# EasyEDA schematic SCH_depth-sensor_2025-08-24.json
TITLE: Sheet_1; REV: 1.0; Date: 2025-07-07; Sheet: 1/1; Drawn By: saymonislam924; Company: Your Company
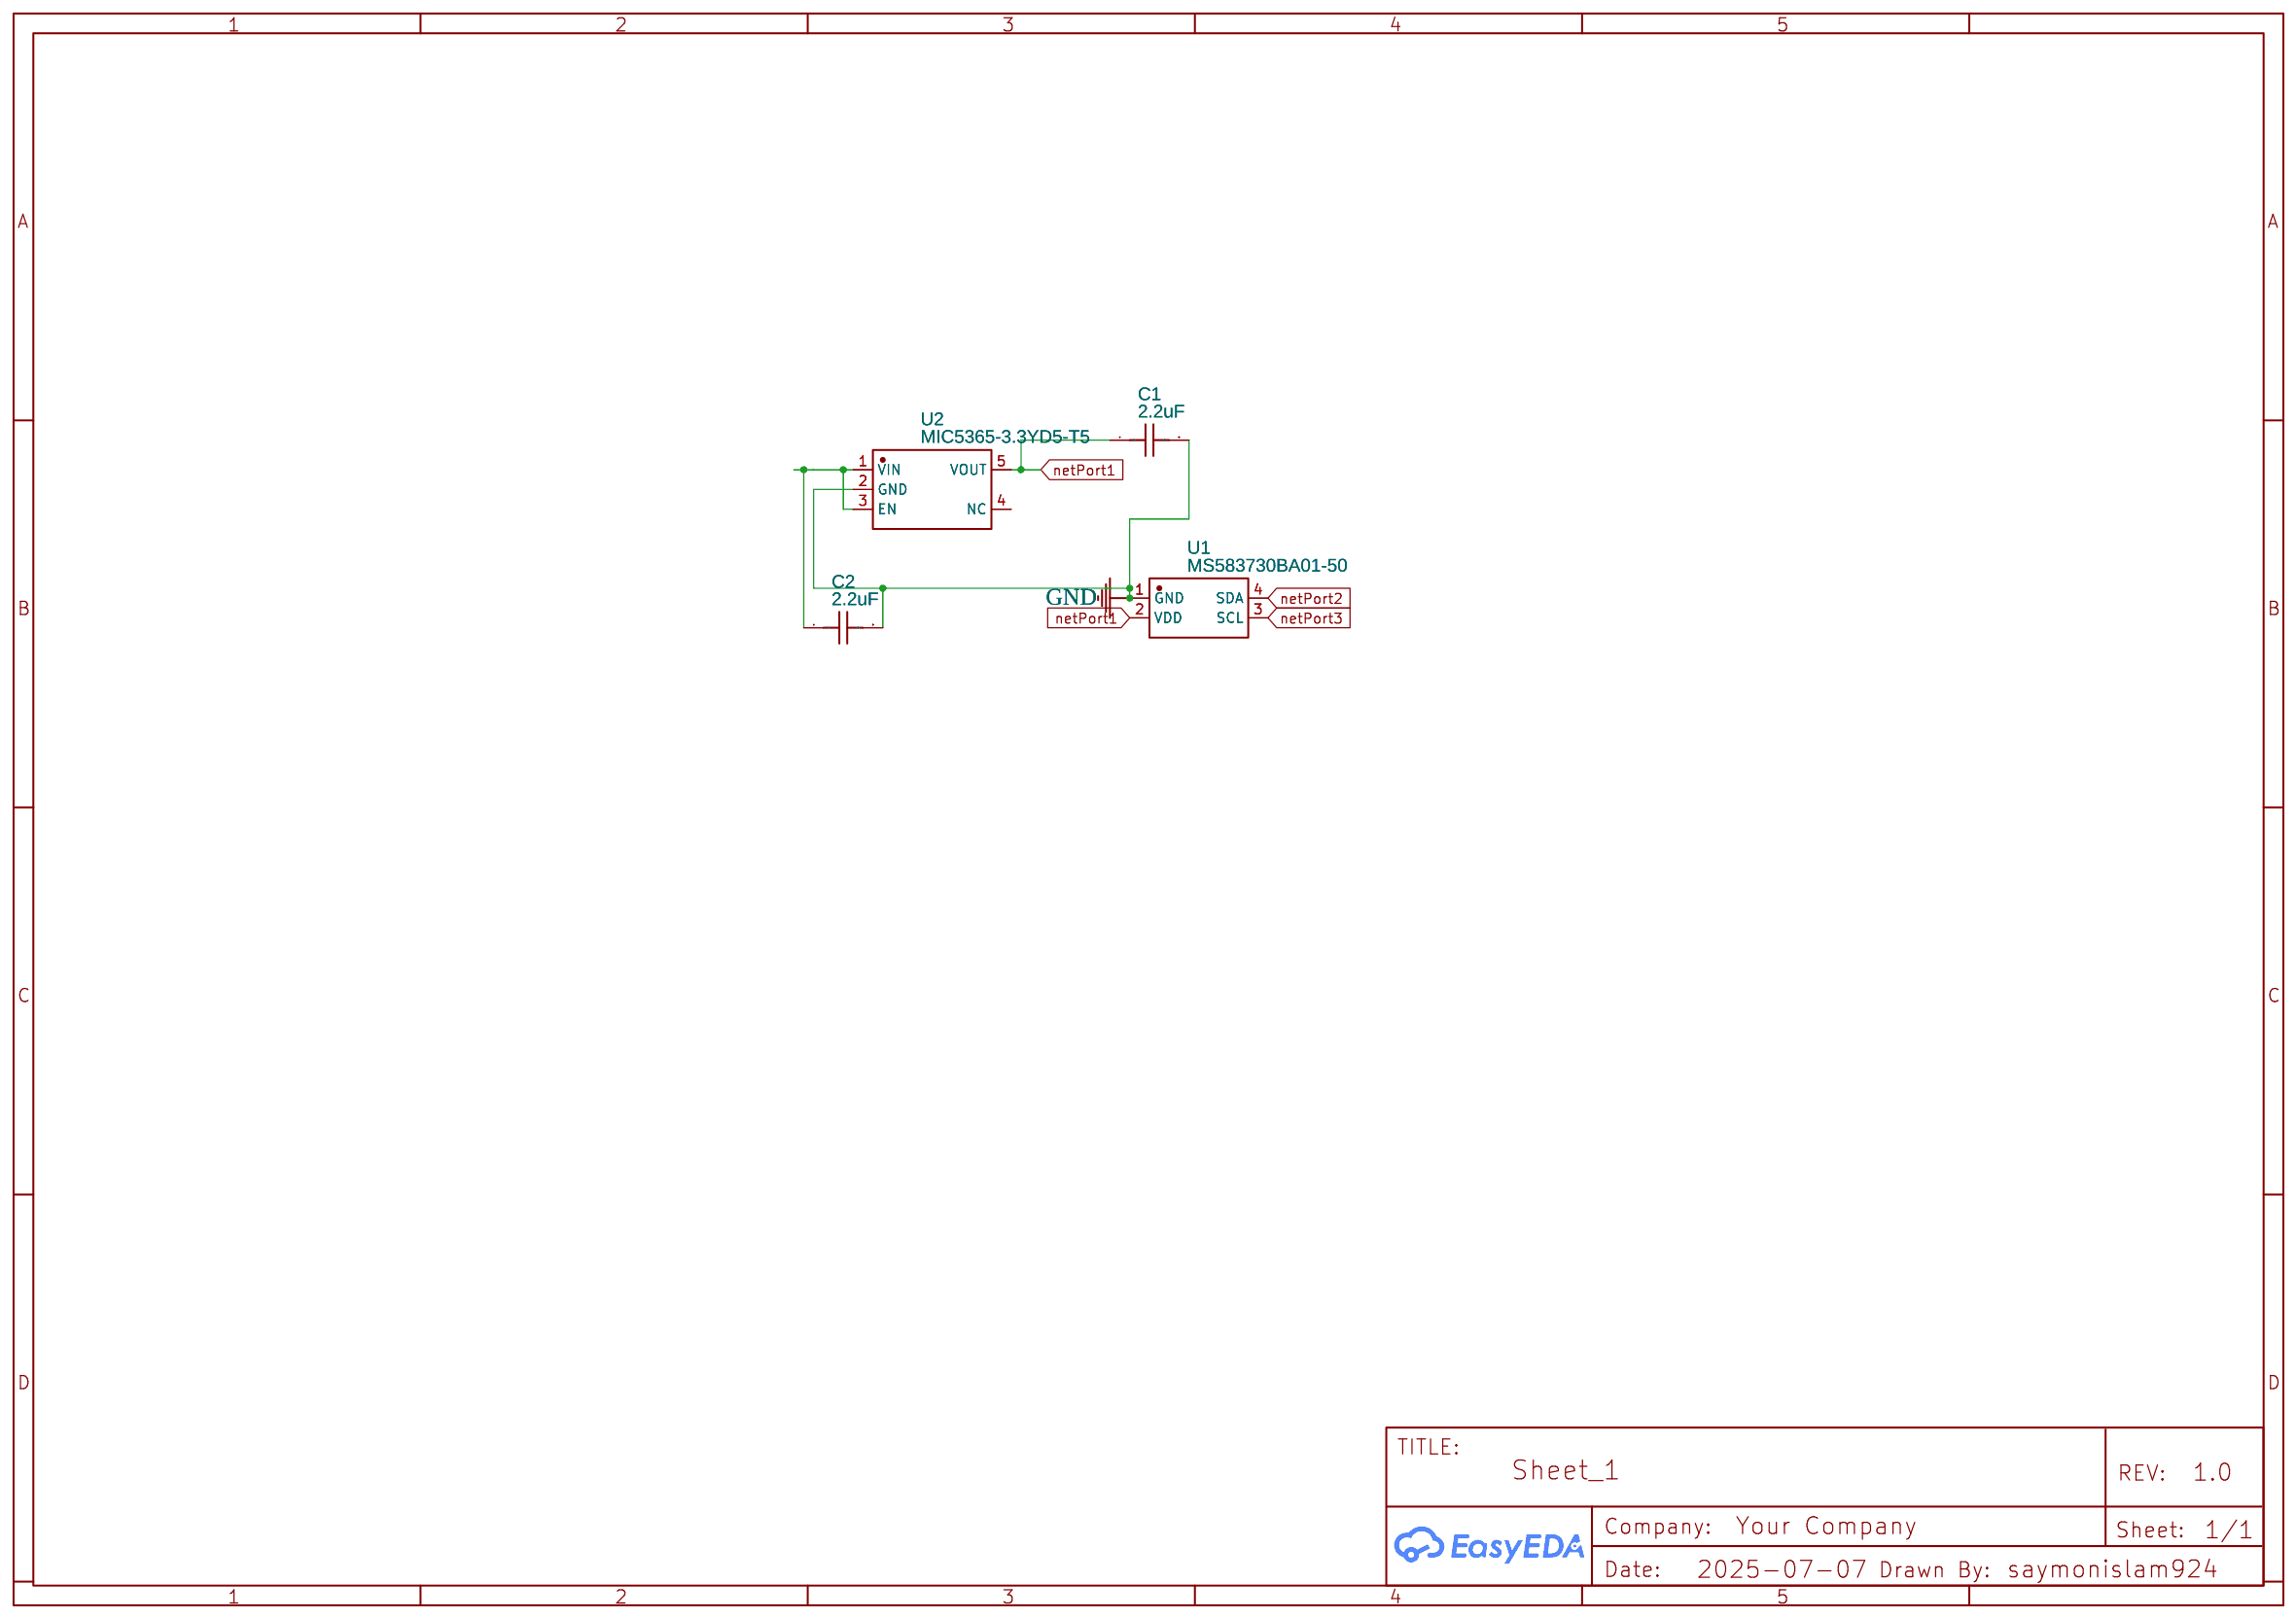
[diagram p0: schematic sheet]

## Parts
C1  2.2uF  [C0603]
C2  2.2uF  [C0603]
U1  MS583730BA01-50  [SENSOR-SMD_4P-L3.3-W3.3-P2.00-BL]
U2  MIC5365-3.3YD5-T5  [TSOT-23-5_L2.9-W1.6-P0.95-LS2.8-BR]

## Library data of the parts
C1 C2 = CC0603KRX7R5BB225: Contributor: lcsc; Supplier: LCSC; Supplier Part: C914880; Manufacturer: YAGEO(国巨); JLCPCB Part Class: Extended Part
U1 = MS583730BA01-50: Contributor: LCSC; Supplier: LCSC; Supplier Part: C2887941; Manufacturer: TE Connectivity(泰科电子); JLCPCB Part Class: Extended Part
U2 = MIC5365-3.3YD5-T5: Contributor: lcsc; Supplier: LCSC; Supplier Part: C633116; Manufacturer: MICROCHIP(美国微芯); JLCPCB Part Class: Extended Part

## Nets
GND: C1.2 C2.2 U1.1(GND) U2.2(GND)
netPort1: C1.1 U1.2(VDD) U2.5(VOUT)
netPort2: U1.4(SDA)
netPort3: U1.3(SCL)
Net-(C2-1): C2.1 U2.1(VIN) U2.3(EN)

Not connected (* = marked no-connect by the designer): U2 4(NC)
